# Altium schematic sheet 十六路输入.SchDoc: 阿波罗十六路输入控制器
size A4; Revision: V1.0; SheetNumber: 0; SheetTotal: 0
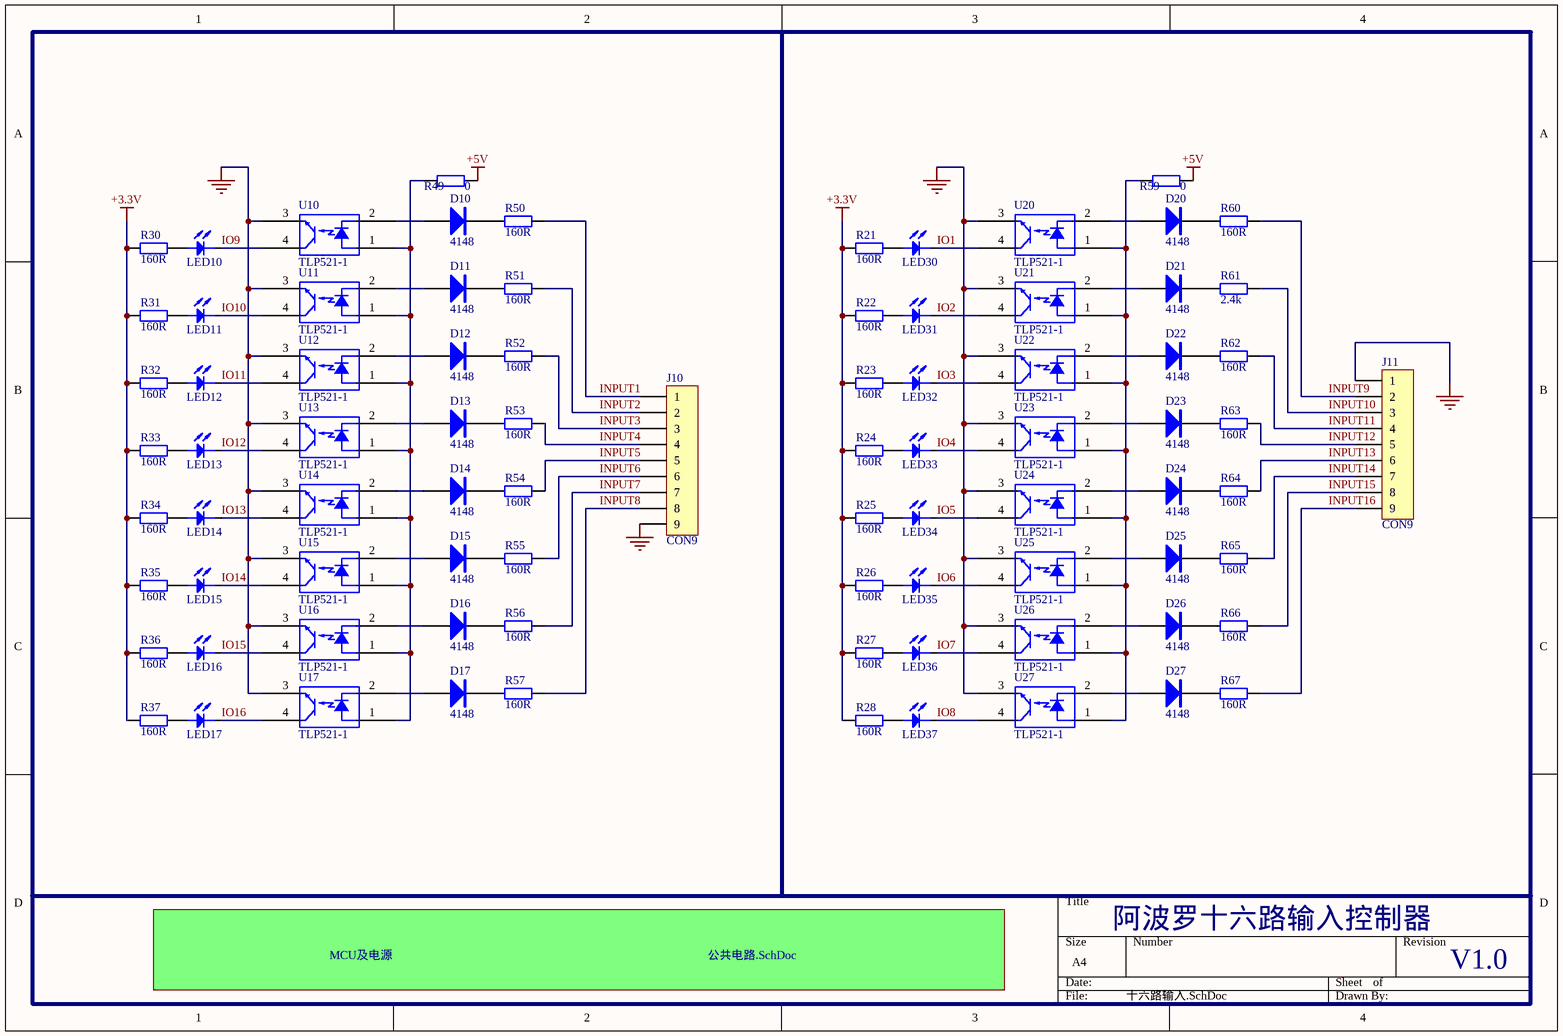
[diagram p0: 十六路输入.SchDoc]

## Parts
D10  4148  [贴片二极管]
D11  4148  [贴片二极管]
D12  4148  [贴片二极管]
D13  4148  [贴片二极管]
D14  4148  [贴片二极管]
D15  4148  [贴片二极管]
D16  4148  [贴片二极管]
D17  4148  [贴片二极管]
D20  4148  [贴片二极管]
D21  4148  [贴片二极管]
D22  4148  [贴片二极管]
D23  4148  [贴片二极管]
D24  4148  [贴片二极管]
D25  4148  [贴片二极管]
D26  4148  [贴片二极管]
D27  4148  [贴片二极管]
J10  CON9  [CON9*5.1]
J11  CON9  [CON9*5.1]
LED10  LED  [LED2.5]  (value not drawn)
LED11  LED  [LED2.5]  (value not drawn)
LED12  LED  [LED2.5]  (value not drawn)
LED13  LED  [LED2.5]  (value not drawn)
LED14  LED  [LED2.5]  (value not drawn)
LED15  LED  [LED2.5]  (value not drawn)
LED16  LED  [LED2.5]  (value not drawn)
LED17  LED  [LED2.5]  (value not drawn)
LED30  LED  [LED2.5]  (value not drawn)
LED31  LED  [LED2.5]  (value not drawn)
LED32  LED  [LED2.5]  (value not drawn)
LED33  LED  [LED2.5]  (value not drawn)
LED34  LED  [LED2.5]  (value not drawn)
LED35  LED  [LED2.5]  (value not drawn)
LED36  LED  [LED2.5]  (value not drawn)
LED37  LED  [LED2.5]  (value not drawn)
R21  160R  [0603A]
R22  160R  [0603A]
R23  160R  [0603A]
R24  160R  [0603A]
R25  160R  [0603A]
R26  160R  [0603A]
R27  160R  [0603A]
R28  160R  [0603A]
R30  160R  [0603A]
R31  160R  [0603A]
R32  160R  [0603A]
R33  160R  [0603A]
R34  160R  [0603A]
R35  160R  [0603A]
R36  160R  [0603A]
R37  160R  [0603A]
R49  0  [0603A]
R50  160R  [0603A]
R51  160R  [0603A]
R52  160R  [0603A]
R53  160R  [0603A]
R54  160R  [0603A]
R55  160R  [0603A]
R56  160R  [0603A]
R57  160R  [0603A]
R59  0  [0603A]
R60  160R  [0603A]
R61  2.4k  [0603A]
R62  160R  [0603A]
R63  160R  [0603A]
R64  160R  [0603A]
R65  160R  [0603A]
R66  160R  [0603A]
R67  160R  [0603A]
U10  TLP521-1  [PC817]
U11  TLP521-1  [PC817]
U12  TLP521-1  [PC817]
U13  TLP521-1  [PC817]
U14  TLP521-1  [PC817]
U15  TLP521-1  [PC817]
U16  TLP521-1  [PC817]
U17  TLP521-1  [PC817]
U20  TLP521-1  [PC817]
U21  TLP521-1  [PC817]
U22  TLP521-1  [PC817]
U23  TLP521-1  [PC817]
U24  TLP521-1  [PC817]
U25  TLP521-1  [PC817]
U26  TLP521-1  [PC817]
U27  TLP521-1  [PC817]

## Sub-sheets
MCU及电源 = 公共电路.SchDoc: no entries

## Nets
+3.3V: R21.1 R22.1 R23.1 R24.1 R25.1 R26.1 R27.1 R28.1 R30.1 R31.1 R32.1 R33.1 R34.1 R35.1 R36.1 R37.1
+5V: R49.2 R59.2
GND: J10.9 J11.1 U10.3(EMIT) U11.3(EMIT) U12.3(EMIT) U13.3(EMIT) U14.3(EMIT) U15.3(EMIT) U16.3(EMIT) U17.3(EMIT) U20.3(EMIT) U21.3(EMIT) U22.3(EMIT) U23.3(EMIT) U24.3(EMIT) U25.3(EMIT) U26.3(EMIT) U27.3(EMIT)
INPUT1: J10.1 R50.2
INPUT2: J10.2 R51.2
INPUT3: J10.3 R52.2
INPUT4: J10.4 R53.2
INPUT5: J10.5 R54.2
INPUT6: J10.6 R55.2
INPUT7: J10.7 R56.2
INPUT8: J10.8 R57.2
INPUT9: J11.2 R60.2
INPUT10: J11.3 R61.2
INPUT11: J11.4 R62.2
INPUT12: J11.5 R63.2
INPUT13: J11.6 R64.2
INPUT14: J11.7 R65.2
INPUT15: J11.8 R66.2
INPUT16: J11.9 R67.2
IO1: LED30.K U20.4(COL)
IO2: LED31.K U21.4(COL)
IO3: LED32.K U22.4(COL)
IO4: LED33.K U23.4(COL)
IO5: LED34.K U24.4(COL)
IO6: LED35.K U25.4(COL)
IO7: LED36.K U26.4(COL)
IO8: LED37.K U27.4(COL)
IO9: LED10.K U10.4(COL)
IO10: LED11.K U11.4(COL)
IO11: LED12.K U12.4(COL)
IO12: LED13.K U13.4(COL)
IO13: LED14.K U14.4(COL)
IO14: LED15.K U15.4(COL)
IO15: LED16.K U16.4(COL)
IO16: LED17.K U17.4(COL)
NetD10_A: D10.A U10.2(CATH)
NetD10_K: D10.K R50.1
NetD11_A: D11.A U11.2(CATH)
NetD11_K: D11.K R51.1
NetD12_A: D12.A U12.2(CATH)
NetD12_K: D12.K R52.1
NetD13_A: D13.A U13.2(CATH)
NetD13_K: D13.K R53.1
NetD14_A: D14.A U14.2(CATH)
NetD14_K: D14.K R54.1
NetD15_A: D15.A U15.2(CATH)
NetD15_K: D15.K R55.1
NetD16_A: D16.A U16.2(CATH)
NetD16_K: D16.K R56.1
NetD17_A: D17.A U17.2(CATH)
NetD17_K: D17.K R57.1
NetD20_A: D20.A U20.2(CATH)
NetD20_K: D20.K R60.1
NetD21_A: D21.A U21.2(CATH)
NetD21_K: D21.K R61.1
NetD22_A: D22.A U22.2(CATH)
NetD22_K: D22.K R62.1
NetD23_A: D23.A U23.2(CATH)
NetD23_K: D23.K R63.1
NetD24_A: D24.A U24.2(CATH)
NetD24_K: D24.K R64.1
NetD25_A: D25.A U25.2(CATH)
NetD25_K: D25.K R65.1
NetD26_A: D26.A U26.2(CATH)
NetD26_K: D26.K R66.1
NetD27_A: D27.A U27.2(CATH)
NetD27_K: D27.K R67.1
NetLED10_A: LED10.A R30.2
NetLED11_A: LED11.A R31.2
NetLED12_A: LED12.A R32.2
NetLED13_A: LED13.A R33.2
NetLED14_A: LED14.A R34.2
NetLED15_A: LED15.A R35.2
NetLED16_A: LED16.A R36.2
NetLED17_A: LED17.A R37.2
NetLED30_A: LED30.A R21.2
NetLED31_A: LED31.A R22.2
NetLED32_A: LED32.A R23.2
NetLED33_A: LED33.A R24.2
NetLED34_A: LED34.A R25.2
NetLED35_A: LED35.A R26.2
NetLED36_A: LED36.A R27.2
NetLED37_A: LED37.A R28.2
NetR49_1: R49.1 U10.1(ANODE) U11.1(ANODE) U12.1(ANODE) U13.1(ANODE) U14.1(ANODE) U15.1(ANODE) U16.1(ANODE) U17.1(ANODE)
NetR59_1: R59.1 U20.1(ANODE) U21.1(ANODE) U22.1(ANODE) U23.1(ANODE) U24.1(ANODE) U25.1(ANODE) U26.1(ANODE) U27.1(ANODE)

## Library data of the parts
D10-D17 D20-D27 = 二极管
R21-R28 R30-R37 R49-R57 R59-R67 = Res2: Resistor; Value: 1K; Published: 8-Jun-2000; LatestRevisionDate: 17-Jul-2002; LatestRevisionNote: Re-released for DXP Platform.; PackageReference: AXIAL-0.4; Publisher: Altium Limited
U10-U17 U20-U27 = TLP521-1: Single NPN PhotoTransistor OptoCoupler.